# Altium schematic sheet Sensor Brushless Driver V1.0.SchDoc
size 441 x 223 mm
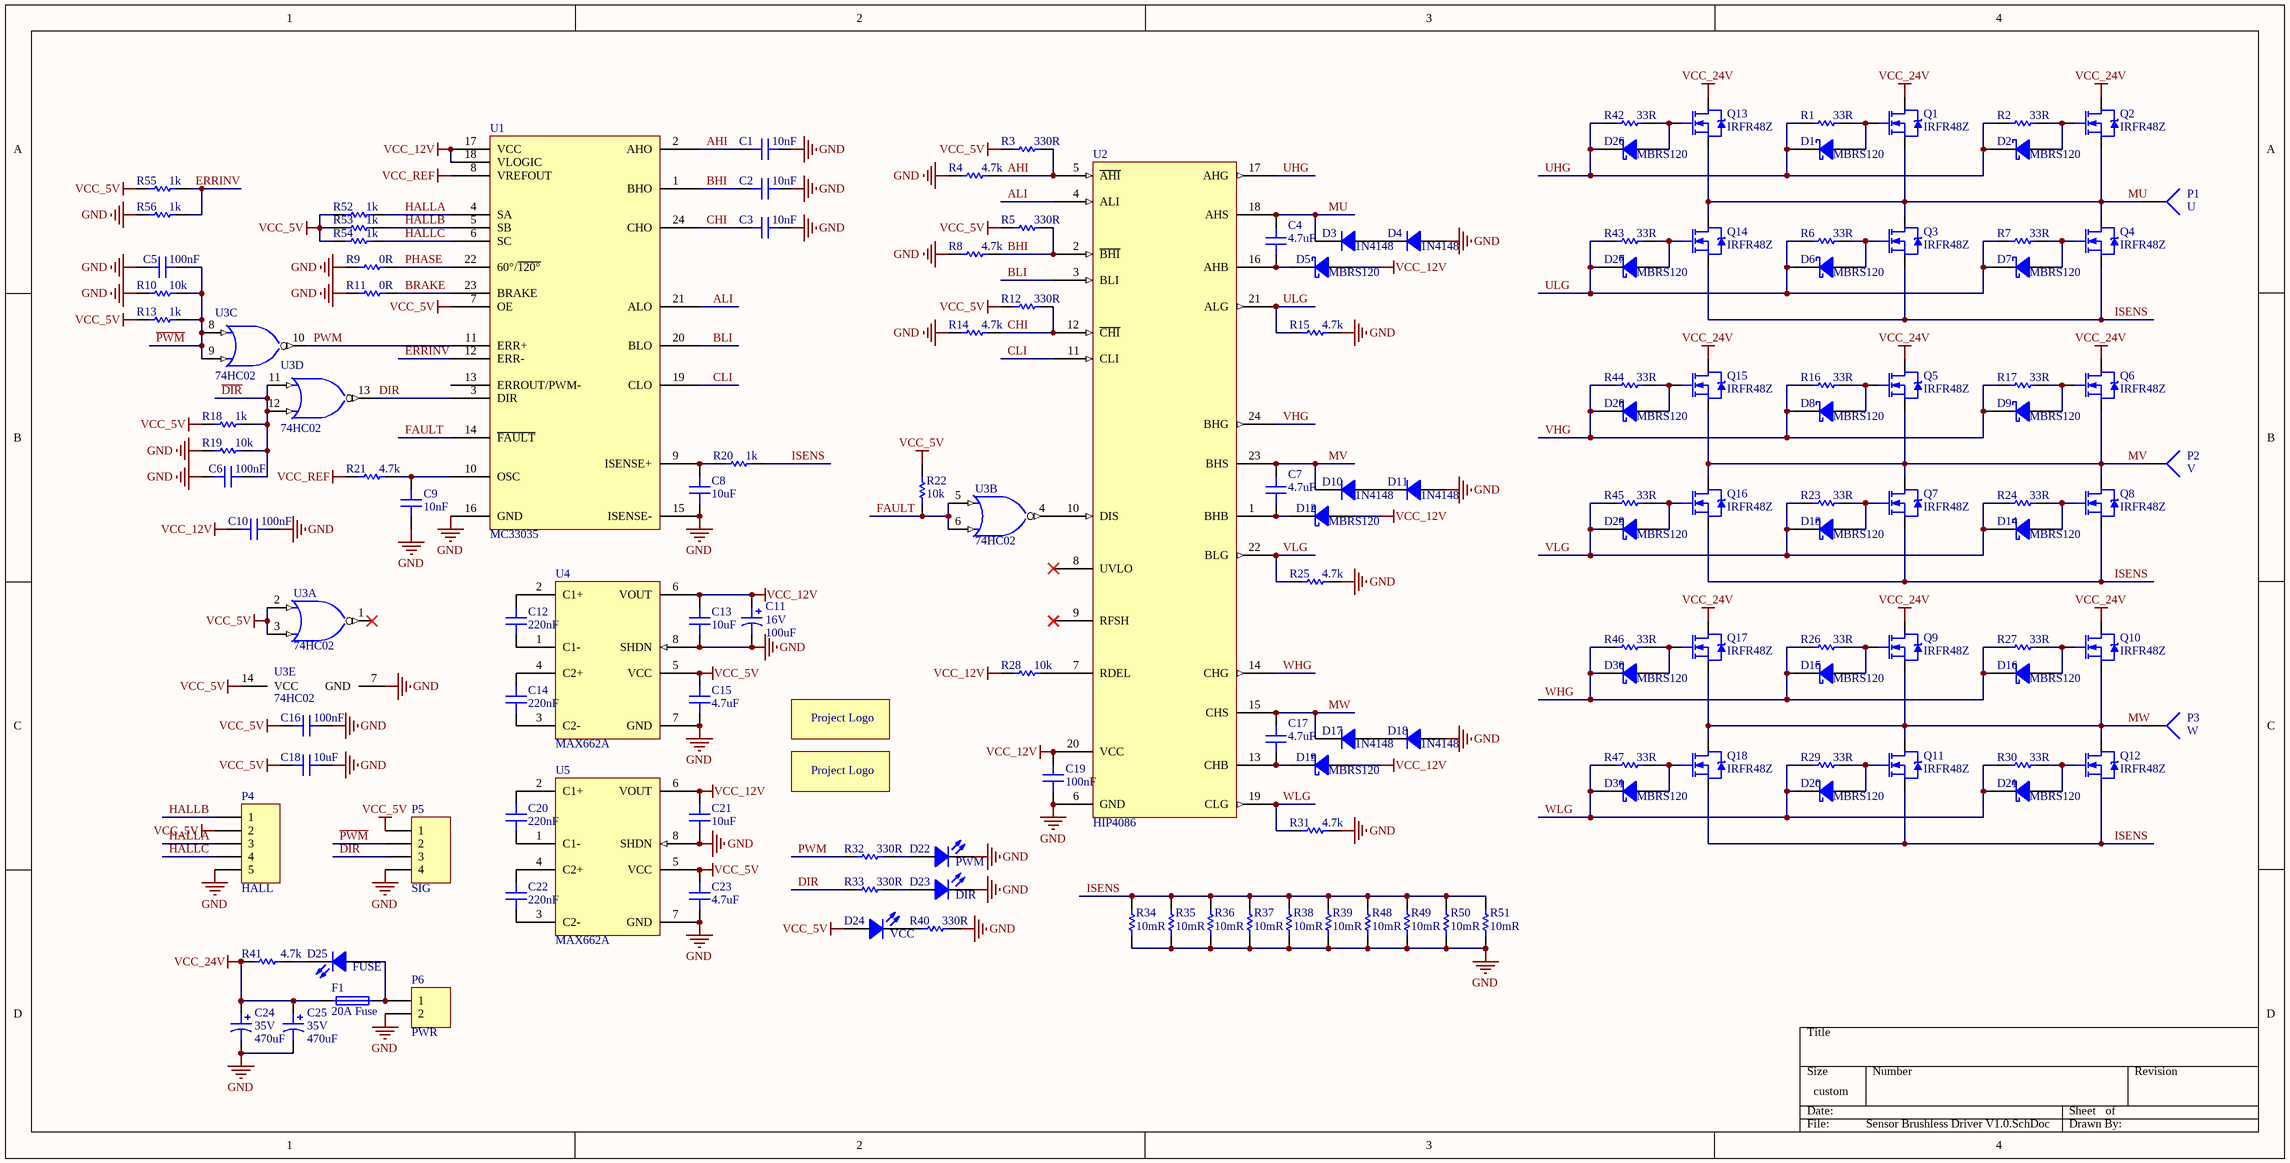
[diagram p0: Sensor Brushless Driver V1.0.SchDoc]

## Parts
C1  10nF  [CC2012-0805]
C2  10nF  [CC2012-0805]
C3  10nF  [CC2012-0805]
C4  4.7uF  [CC2012-0805]
C5  100nF  [CC2012-0805]
C6  100nF  [CC2012-0805]
C7  4.7uF  [CC2012-0805]
C8  10uF  [CC3216-1206]
C9  10nF  [CC2012-0805]
C10  100nF  [CC2012-0805]
C11  100uF  Voltage: 16V  [EIA7343]
C12  220nF  [CC2012-0805]
C13  10uF  [CC3216-1206]
C14  220nF  [CC2012-0805]
C15  4.7uF  [CC2012-0805]
C16  100nF  [CC2012-0805]
C17  4.7uF  [CC2012-0805]
C18  10uF  [CC3216-1206]
C19  100nF  [CC2012-0805]
C20  220nF  [CC2012-0805]
C21  10uF  [CC3216-1206]
C22  220nF  [CC2012-0805]
C23  4.7uF  [CC2012-0805]
C24  470uF  Voltage: 35V  [CAP10x12]
C25  470uF  Voltage: 35V  [CAP10x12]
D1  MBRS120  [SMA]
D2  MBRS120  [SMA]
D3  1N4148  [SOD-80]
D4  1N4148  [SOD-80]
D5  MBRS120  [SMA]
D6  MBRS120  [SMA]
D7  MBRS120  [SMA]
D8  MBRS120  [SMA]
D9  MBRS120  [SMA]
D10  1N4148  [SOD-80]
D11  1N4148  [SOD-80]
D12  MBRS120  [SMA]
D13  MBRS120  [SMA]
D14  MBRS120  [SMA]
D15  MBRS120  [SMA]
D16  MBRS120  [SMA]
D17  1N4148  [SOD-80]
D18  1N4148  [SOD-80]
D19  MBRS120  [SMA]
D20  MBRS120  [SMA]
D21  MBRS120  [SMA]
D22  PWM  [D0805]
D23  DIR  [D0805]
D24  VCC  [D0805]
D25  FUSE  [D0805]
D26  MBRS120  [SMA]
D27  MBRS120  [SMA]
D28  MBRS120  [SMA]
D29  MBRS120  [SMA]
D30  MBRS120  [SMA]
D31  MBRS120  [SMA]
F1  20A Fuse  [FUSE SOCKET]
P1  U  [2.5X4_WIRE_PAD]
P2  V  [2.5X4_WIRE_PAD]
P3  W  [2.5X4_WIRE_PAD]
P4  HALL  [LOCKEDHDR-5W]
P5  SIG  [LOCKEDHDR-4W]
P6  PWR  [T-CONNECTOR(M)]
Project1  Project Logo  [Robocon_Logo]  (value not drawn)
Project2  Project Logo  [Robocon_Logo]  (value not drawn)
Q1  IRFR48Z  [TO-252AA]
Q2  IRFR48Z  [TO-252AA]
Q3  IRFR48Z  [TO-252AA]
Q4  IRFR48Z  [TO-252AA]
Q5  IRFR48Z  [TO-252AA]
Q6  IRFR48Z  [TO-252AA]
Q7  IRFR48Z  [TO-252AA]
Q8  IRFR48Z  [TO-252AA]
Q9  IRFR48Z  [TO-252AA]
Q10  IRFR48Z  [TO-252AA]
Q11  IRFR48Z  [TO-252AA]
Q12  IRFR48Z  [TO-252AA]
Q13  IRFR48Z  [TO-252AA]
Q14  IRFR48Z  [TO-252AA]
Q15  IRFR48Z  [TO-252AA]
Q16  IRFR48Z  [TO-252AA]
Q17  IRFR48Z  [TO-252AA]
Q18  IRFR48Z  [TO-252AA]
R1  33R  [CR2012-0805]
R2  33R  [CR2012-0805]
R3  330R  [CR2012-0805]
R4  4.7k  [CR2012-0805]
R5  330R  [CR2012-0805]
R6  33R  [CR2012-0805]
R7  33R  [CR2012-0805]
R8  4.7k  [CR2012-0805]
R9  0R  [CR2012-0805]
R10  10k  [CR2012-0805]
R11  0R  [CR2012-0805]
R12  330R  [CR2012-0805]
R13  1k  [CR2012-0805]
R14  4.7k  [CR2012-0805]
R15  4.7k  [CR2012-0805]
R16  33R  [CR2012-0805]
R17  33R  [CR2012-0805]
R18  1k  [CR2012-0805]
R19  10k  [CR2012-0805]
R20  1k  [CR2012-0805]
R21  4.7k  [CR2012-0805]
R22  10k  [CR2012-0805]
R23  33R  [CR2012-0805]
R24  33R  [CR2012-0805]
R25  4.7k  [CR2012-0805]
R26  33R  [CR2012-0805]
R27  33R  [CR2012-0805]
R28  10k  [CR2012-0805]
R29  33R  [CR2012-0805]
R30  33R  [CR2012-0805]
R31  4.7k  [CR2012-0805]
R32  330R  [CR2012-0805]
R33  330R  [CR2012-0805]
R34  10mR  [CR6332-2512]
R35  10mR  [CR6332-2512]
R36  10mR  [CR6332-2512]
R37  10mR  [CR6332-2512]
R38  10mR  [CR6332-2512]
R39  10mR  [CR6332-2512]
R40  330R  [CR2012-0805]
R41  4.7k  [CR2012-0805]
R42  33R  [CR2012-0805]
R43  33R  [CR2012-0805]
R44  33R  [CR2012-0805]
R45  33R  [CR2012-0805]
R46  33R  [CR2012-0805]
R47  33R  [CR2012-0805]
R48  10mR  [CR6332-2512]
R49  10mR  [CR6332-2512]
R50  10mR  [CR6332-2512]
R51  10mR  [CR6332-2512]
R52  1k  [CR2012-0805]
R53  1k  [CR2012-0805]
R54  1k  [CR2012-0805]
R55  1k  [CR2012-0805]
R56  1k  [CR2012-0805]
U1  MC33035  [SOP-24]
U2  HIP4086  [SOP-24]
U3  74HC02  [SOP-14]  (parts A,B,C,D,E of 5)
U4  MAX662A  [SOP-8]
U5  MAX662A  [SOP-8]

## Nets
GND: C1.1 C2.1 C3.1 C5.2 C6.2 C8.2 C9.2 C10.2 C11.2 C13.2 C15.2 C16.2 C18.2 C19.2 C21.2 C23.2 C24.2 C25.2 D4.1(A) D11.1(A) D18.1(A) D22.2(K) D23.2(K) P4.5 P5.4 P6.2 R4.2 R8.2 R9.2 R10.2 R11.2 R14.2 R15.1 R19.2 R25.1 R31.1 R34.1 R35.1 R36.1 R37.1 R38.1 R39.1 R40.1 R48.1 R49.1 R50.1 R51.1 R56.2 U1.15(ISENSE-) U1.16(GND) U2.6(GND) U3.7(GND) U4.7(GND) U4.8(SHDN) U5.7(GND) U5.8(SHDN)
VCC_5V: C15.1 C16.1 C18.1 C23.1 D24.1(A) P4.2 P5.1 R3.2 R5.2 R12.2 R13.2 R18.2 R22.2 R52.2 R53.2 R54.2 R55.2 U1.7(OE) U3.2(1A) U3.3(1B) U3.14(VCC) U4.5(VCC) U5.5(VCC)
VCC_12V: C10.1 C11.1 C13.1 C19.1 C21.1 D5.1(A) D12.1(A) D19.1(A) R28.2 U1.17(VCC) U1.18(VLOGIC) U2.20(VCC) U4.6(VOUT) U5.6(VOUT)
VCC_24V: C24.1 C25.1 F1.1 Q1.4(D) Q2.4(D) Q5.4(D) Q6.4(D) Q9.4(D) Q10.4(D) Q13.4(D) Q15.4(D) Q17.4(D) R41.1
VCC_REF: R21.1 U1.8(VREFOUT)
AHI: C1.2 R3.1 R4.1 U1.2(AHO) U2.5(~{AHI})
ALI: U1.21(ALO) U2.4(ALI)
BHI: C2.2 R5.1 R8.1 U1.1(BHO) U2.2(~{BHI})
BLI: U1.20(BLO) U2.3(BLI)
BRAKE: R11.1 U1.23(BRAKE)
CHI: C3.2 R12.1 R14.1 U1.24(CHO) U2.12(~{CHI})
CLI: U1.19(CLO) U2.11(CLI)
~{DIR}: C6.1 P5.3 R18.1 R19.1 U3.11(4A) U3.12(4B)
DIR: R33.2 U1.3(DIR) U3.13(4Y)
ERRINV: R55.1 R56.1 U1.12(ERR-)
FAULT: R22.1 U1.14(~{FAULT}) U3.5(2A) U3.6(2B)
HALLA: P4.3 R52.1 U1.4(SA)
HALLB: P4.1 R53.1 U1.5(SB)
HALLC: P4.4 R54.1 U1.6(SC)
ISENS: Q3.3(S) Q4.3(S) Q7.3(S) Q8.3(S) Q11.3(S) Q12.3(S) Q14.3(S) Q16.3(S) Q18.3(S) R20.1 R34.2 R35.2 R36.2 R37.2 R38.2 R39.2 R48.2 R49.2 R50.2 R51.2
MU: C4.2 D3.2(K) P1.1 Q1.3(S) Q2.3(S) Q3.4(D) Q4.4(D) Q13.3(S) Q14.4(D) U2.18(AHS)
MV: C7.2 D10.2(K) P2.1 Q5.3(S) Q6.3(S) Q7.4(D) Q8.4(D) Q15.3(S) Q16.4(D) U2.23(BHS)
MW: C17.2 D17.2(K) P3.1 Q9.3(S) Q10.3(S) Q11.4(D) Q12.4(D) Q17.3(S) Q18.4(D) U2.15(CHS)
~{PWM}: C5.1 P5.2 R10.1 R13.1 U3.8(3A) U3.9(3B)
PHASE: R9.1 U1.22(60°/~{120°})
PWM: R32.2 U1.11(ERR+) U3.10(3Y)
UHG: D1.2(K) D2.2(K) D26.2(K) R1.1 R2.1 R42.1 U2.17(AHG)
ULG: D6.2(K) D7.2(K) D27.2(K) R6.1 R7.1 R15.2 R43.1 U2.21(ALG)
VHG: D8.2(K) D9.2(K) D28.2(K) R16.1 R17.1 R44.1 U2.24(BHG)
VLG: D13.2(K) D14.2(K) D29.2(K) R23.1 R24.1 R25.2 R45.1 U2.22(BLG)
WHG: D15.2(K) D16.2(K) D30.2(K) R26.1 R27.1 R46.1 U2.14(CHG)
WLG: D20.2(K) D21.2(K) D31.2(K) R29.1 R30.1 R31.2 R47.1 U2.19(CLG)
NetC4_1: C4.1 D5.2(K) U2.16(AHB)
NetC7_1: C7.1 D12.2(K) U2.1(BHB)
NetC8_1: C8.1 R20.2 U1.9(ISENSE+)
NetC9_1: C9.1 R21.2 U1.10(OSC)
NetC12_1: C12.1 U4.1(C1-)
NetC12_2: C12.2 U4.2(C1+)
NetC14_1: C14.1 U4.3(C2-)
NetC14_2: C14.2 U4.4(C2+)
NetC17_1: C17.1 D19.2(K) U2.13(CHB)
NetC20_1: C20.1 U5.1(C1-)
NetC20_2: C20.2 U5.2(C1+)
NetC22_1: C22.1 U5.3(C2-)
NetC22_2: C22.2 U5.4(C2+)
NetD1_1: D1.1(A) Q1.1(G) R1.2
NetD2_1: D2.1(A) Q2.1(G) R2.2
NetD3_1: D3.1(A) D4.2(K)
NetD6_1: D6.1(A) Q3.1(G) R6.2
NetD7_1: D7.1(A) Q4.1(G) R7.2
NetD8_1: D8.1(A) Q5.1(G) R16.2
NetD9_1: D9.1(A) Q6.1(G) R17.2
NetD10_1: D10.1(A) D11.2(K)
NetD13_1: D13.1(A) Q7.1(G) R23.2
NetD14_1: D14.1(A) Q8.1(G) R24.2
NetD15_1: D15.1(A) Q9.1(G) R26.2
NetD16_1: D16.1(A) Q10.1(G) R27.2
NetD17_1: D17.1(A) D18.2(K)
NetD20_1: D20.1(A) Q11.1(G) R29.2
NetD21_1: D21.1(A) Q12.1(G) R30.2
NetD22_1: D22.1(A) R32.1
NetD23_1: D23.1(A) R33.1
NetD24_2: D24.2(K) R40.2
NetD25_1: D25.1(A) F1.2 P6.1
NetD25_2: D25.2(K) R41.2
NetD26_1: D26.1(A) Q13.1(G) R42.2
NetD27_1: D27.1(A) Q14.1(G) R43.2
NetD28_1: D28.1(A) Q15.1(G) R44.2
NetD29_1: D29.1(A) Q16.1(G) R45.2
NetD30_1: D30.1(A) Q17.1(G) R46.2
NetD31_1: D31.1(A) Q18.1(G) R47.2
NetR28_1: R28.1 U2.7(RDEL)
NetU2_10: U2.10(DIS) U3.4(2Y)

Not connected (* = marked no-connect by the designer): U1 13(ERROUT/PWM-); U2 8(UVLO)* 9(RFSH)*; U3 1(1Y)*

## Library data of the parts
C1-C10 C12-C23 = Cap Semi: Capacitor (Semiconductor SIM Model); Published: 8-Jun-2000; LatestRevisionDate: 17-Jul-2002; LatestRevisionNote: Re-released for DXP Platform.; PackageReference: C1206; Publisher: Altium Limited
C11 = Cap Pol SMD: Polarized Capacitor (Axial); Published: 8-Jun-2000; LatestRevisionDate: 17-Jul-2002; LatestRevisionNote: Re-released for DXP Platform.; Publisher: Altium Limited
C24 C25 = Cap Pol DIP: Polarized Capacitor (Radial); Published: 8-Jun-2000; LatestRevisionDate: 17-Jul-2002; LatestRevisionNote: Re-released for DXP Platform.; Publisher: Altium Limited
D1 D2 D5-D9 D12-D16 D19-D21 D26-D31 = D Schottky: Schottky Diode; Code - JEDEC: DO-214-AA; Published: 8-Jun-2000; Revision: July-2002: Re-released for DXP Platform.; Publisher: Altium Limited
D3 D4 D10 D11 D17 D18 = D General: General Purpose Diode; Revision 1: 11-Jul-2000: SIM Model Added.; Revision 2: 17-Jul-2002: Re-released for DXP Platform.; Code - JEDEC: DO-204-AH; Published: 8-Jun-2000; Datasheet: Latest Revision: 1997; Package Reference: DO-35; Publisher: Altium Limited
D22-D25 = LED: Typical RED GaAs LED; Published: 8-Jun-2000; LatestRevisionDate: 08-Jul-2005; LatestRevisionNote: Mech Layer 1 removed.; PackageReference: LED-1; Publisher: Altium Limited
F1 = Fuse: Published: 8-Jun-2000; Revision: July-2002: Re-released for DXP Platform.; Publisher: Altium Limited
P1-P3 = Socket: LatestRevisionDate: 17-Jul-2002; LatestRevisionNote: Re-released for DXP Platform.; Publisher: Altium Limited
P4 = Header 5: Header, 5-Pin; LatestRevisionDate: 17-Jul-2002; LatestRevisionNote: Re-released for DXP Platform.; Publisher: Altium Limited
P5 = Header 4: Header, 4-Pin; Revision: 17-Jul-2002: Re-released for DXP Platform.; Publisher: Altium Limited
P6 = Header 2: Header, 2-Pin; Revision: 17-Jul-2002: Re-released for DXP Platform.; Publisher: Altium Limited
Q1-Q18 = IRFR48Z: HEXFET N-Channel Power MOSFET; Note: Pin 2 is trimmed and is electrically connected to Drain.; Published: 8-Jun-2000; LatestRevisionDate: 17-Jul-2002; LatestRevisionNote: Re-released for DXP Platform.; DatasheetDocument: Nov-1998; PackageReference: TO-252AA; Publisher: Altium Limited; Code_JEDEC: TO-252-AA
R1-R56 = Res Semi: Semiconductor Resistor; Published: 8-Jun-2000; LatestRevisionDate: 17-Jul-2002; LatestRevisionNote: Re-released for DXP Platform.; Publisher: Altium Limited
U1 = MC33035: 80V/2.5A Peak, High Frequency Full / Bridge FET Driver
U2 = HIP4086: 80V, 500mA, 3-Phase MOSFET Driver80V, 500mA, 3-Phase MOSFET Driver
U3 = 74HC02: Quadruple 2-Input Positive-NOR Gate; Package Information: Latest Revision: Jan-1998; Published: 8-Jun-2000; Revision: 17-Jul-2002: Re-released for DXP Platform.; Datasheet: Latest Revision: Mar-1988; Package Reference: D014; Publisher: Altium Limited
U4 U5 = MAX662A: 5V to 12V Charge Pump